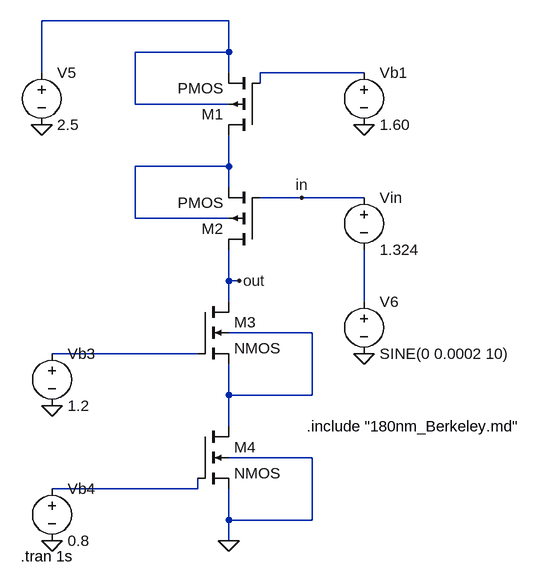
[diagram p0: schematic main.asc]
main.asc, the LTspice schematic file:
Version 4
SHEET 1 880 680
WIRE 160 -352 -128 -352
WIRE 160 -304 160 -352
WIRE 160 -304 16 -304
WIRE -128 -272 -128 -352
WIRE 160 -272 160 -304
WIRE 368 -272 208 -272
WIRE 208 -256 208 -272
WIRE 16 -224 16 -304
WIRE 160 -224 16 -224
WIRE 160 -128 160 -176
WIRE 160 -128 16 -128
WIRE 160 -96 160 -128
WIRE 272 -80 208 -80
WIRE 368 -80 272 -80
WIRE 16 -48 16 -128
WIRE 160 -48 16 -48
WIRE 160 48 160 0
WIRE 176 48 160 48
WIRE 160 80 160 48
WIRE 368 80 368 0
WIRE 288 128 160 128
WIRE 112 160 -112 160
WIRE 160 224 160 176
WIRE 288 224 288 128
WIRE 288 224 160 224
WIRE 160 272 160 224
WIRE 288 320 160 320
WIRE 112 368 112 352
WIRE 112 368 -112 368
WIRE 160 416 160 368
WIRE 288 416 288 320
WIRE 288 416 160 416
WIRE 160 448 160 416
FLAG 160 448 0
FLAG 368 -192 0
FLAG -128 -192 0
FLAG 368 160 0
FLAG -112 240 0
FLAG -112 448 0
FLAG 176 48 out
FLAG 272 -80 in
SYMBOL nmos4 112 272 R0
SYMATTR InstName M4
SYMATTR Value2 l=1800n w=10000n
SYMBOL nmos4 112 80 R0
SYMATTR InstName M3
SYMATTR Value2 l=1800n w=10000n
SYMBOL pmos4 208 0 R180
SYMATTR InstName M2
SYMATTR Value2 l=900n w=18500.8n
SYMBOL pmos4 208 -176 R180
SYMATTR InstName M1
SYMATTR Value2 l=900n w=18500.8n
SYMBOL voltage 368 -288 R0
WINDOW 123 0 0 Left 2
WINDOW 39 0 0 Left 2
SYMATTR InstName Vb1
SYMATTR Value 1.60
SYMBOL voltage 368 -96 R0
WINDOW 123 0 0 Left 2
WINDOW 39 0 0 Left 2
SYMATTR InstName Vin
SYMATTR Value 1.324
SYMBOL voltage -112 144 R0
WINDOW 123 0 0 Left 2
WINDOW 39 0 0 Left 2
SYMATTR InstName Vb3
SYMATTR Value 1.2
SYMBOL voltage -112 352 R0
WINDOW 123 0 0 Left 2
WINDOW 39 0 0 Left 2
SYMATTR InstName Vb4
SYMATTR Value 0.8
SYMBOL voltage -128 -288 R0
WINDOW 123 0 0 Left 2
WINDOW 39 0 0 Left 2
SYMATTR InstName V5
SYMATTR Value 2.5
SYMBOL voltage 368 64 R0
WINDOW 123 0 0 Left 2
WINDOW 39 0 0 Left 2
SYMATTR InstName V6
SYMATTR Value SINE(0 0.0002 10)
TEXT 280 272 Left 2 !.include "180nm_Berkeley.md"
TEXT -160 472 Left 2 !.tran 1s

The netlist it stands for:
* main.asc
M4 N005 N007 0 0 NMOS l=1800n w=10000n
M3 out N006 N005 N005 NMOS l=1800n w=10000n
M2 out in N003 N003 PMOS l=900n w=18500.8n
M1 N003 N002 N001 N001 PMOS l=900n w=18500.8n
Vb1 N002 0 1.60
Vin in N004 1.324
Vb3 N006 0 1.2
Vb4 N007 0 0.8
V5 N001 0 2.5
V6 N004 0 SINE(0 0.0002 10)
.model NMOS NMOS
.model PMOS PMOS
.lib standard.mos
.include "180nm_Berkeley.md"
.tran 1s
.backanno
.end